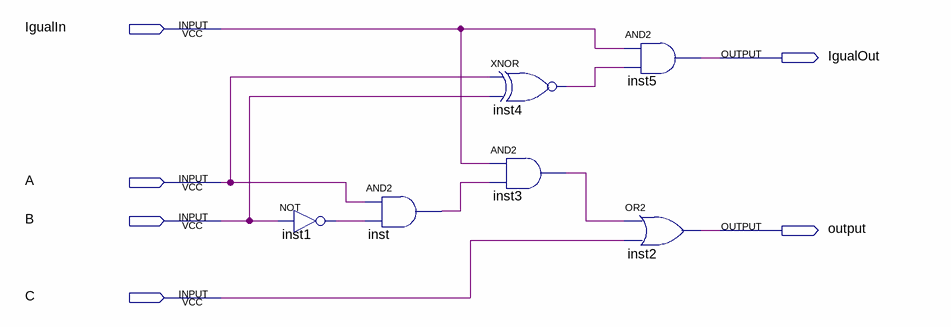
[diagram p0: schematic sheet]
// Quartus schematic CelulaMaior.bdf as structural Verilog: 6 symbols, 6 pins
module CelulaMaior (
  input  IgualIn,
  input  A,
  input  B,
  input  C,
  output IgualOut,
  output \output 
);

  wire inst1_out, inst3_out, inst4_out, inst_out;

  not inst1 (inst1_out, B);
  and inst (inst_out, A, inst1_out);
  xnor inst4 (inst4_out, A, B);
  and inst3 (inst3_out, IgualIn, inst_out);
  and inst5 (IgualOut, IgualIn, inst4_out);
  or inst2 (\output , inst3_out, C);
endmodule
